# Altium schematic sheet PowerSwitch.SchDoc
size A4
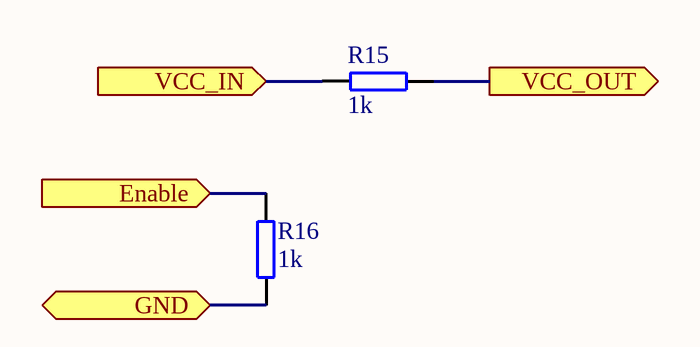
[diagram p0: PowerSwitch.SchDoc]

## Parts
R15  1k  [AXIAL0.4]
R16  1k  [AXIAL0.4]

## Ports
Enable (in), GND (bidir), VCC_IN (in), VCC_OUT (out)

## Nets
Enable: R16.2 ; port Enable
GND: R16.1 ; port GND
VCC_IN: R15.1 ; port VCC_IN
VCC_OUT: R15.2 ; port VCC_OUT

## Library data of the parts
R15 R16 = RES8